# EAGLE design CrowPanel ESP32 Display-5.79(E) Inch (EAGLE 9.6.2)
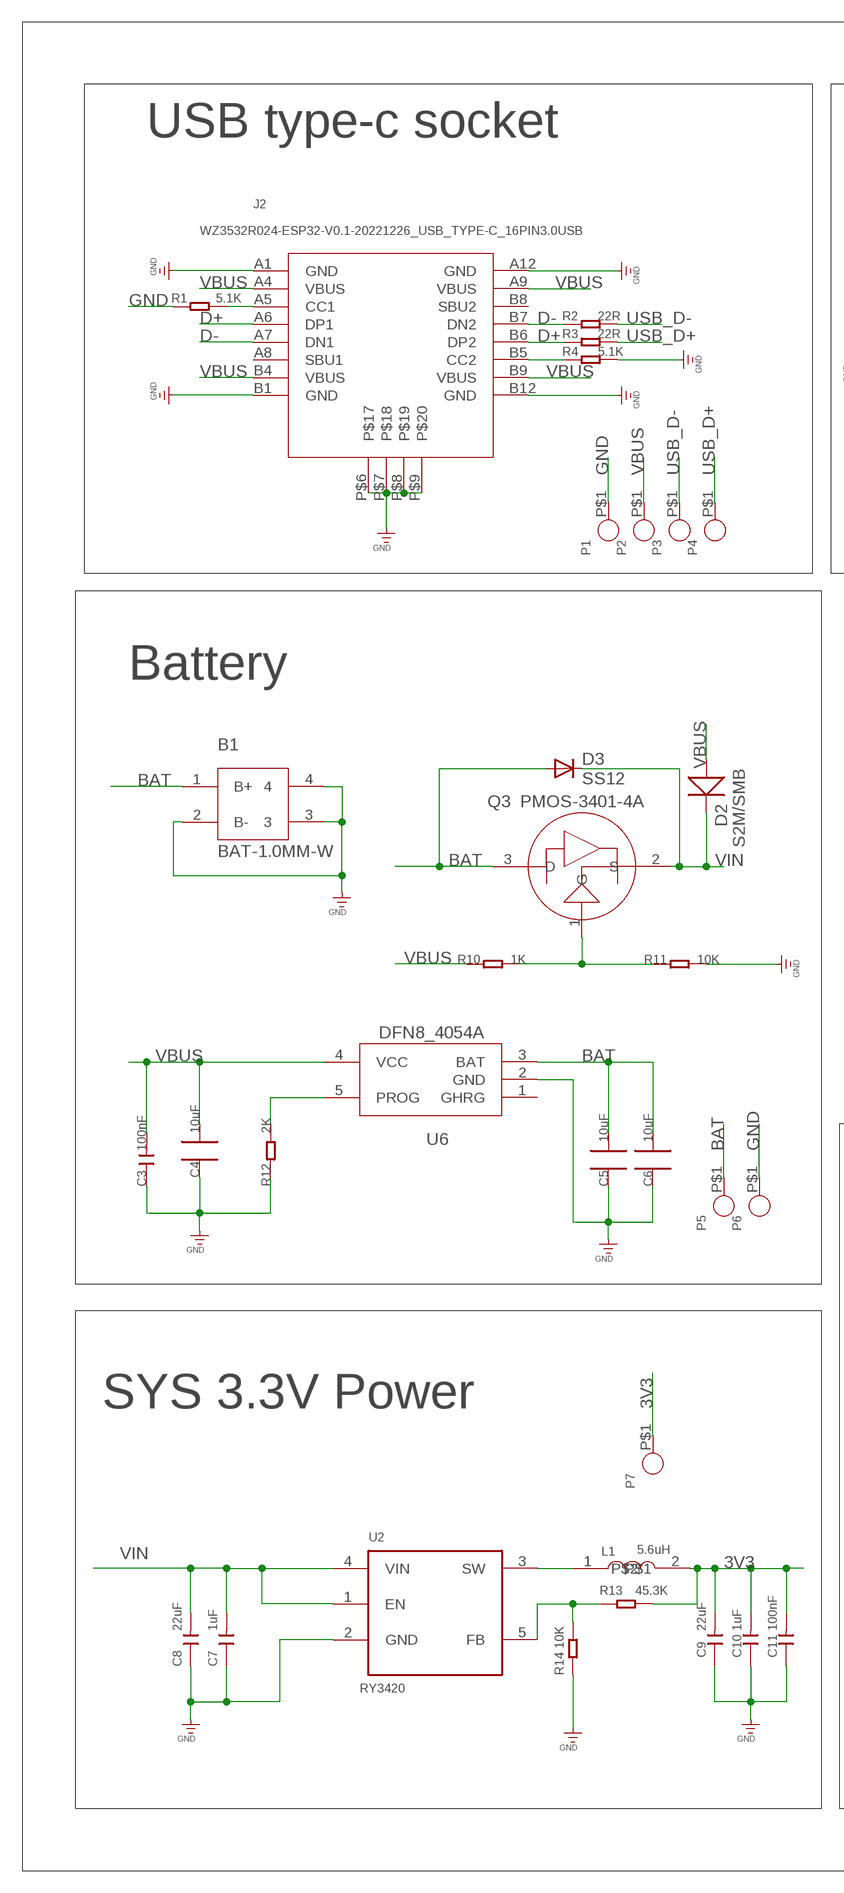
[diagram p0: schematic, sheet 1, part 1 of 2]
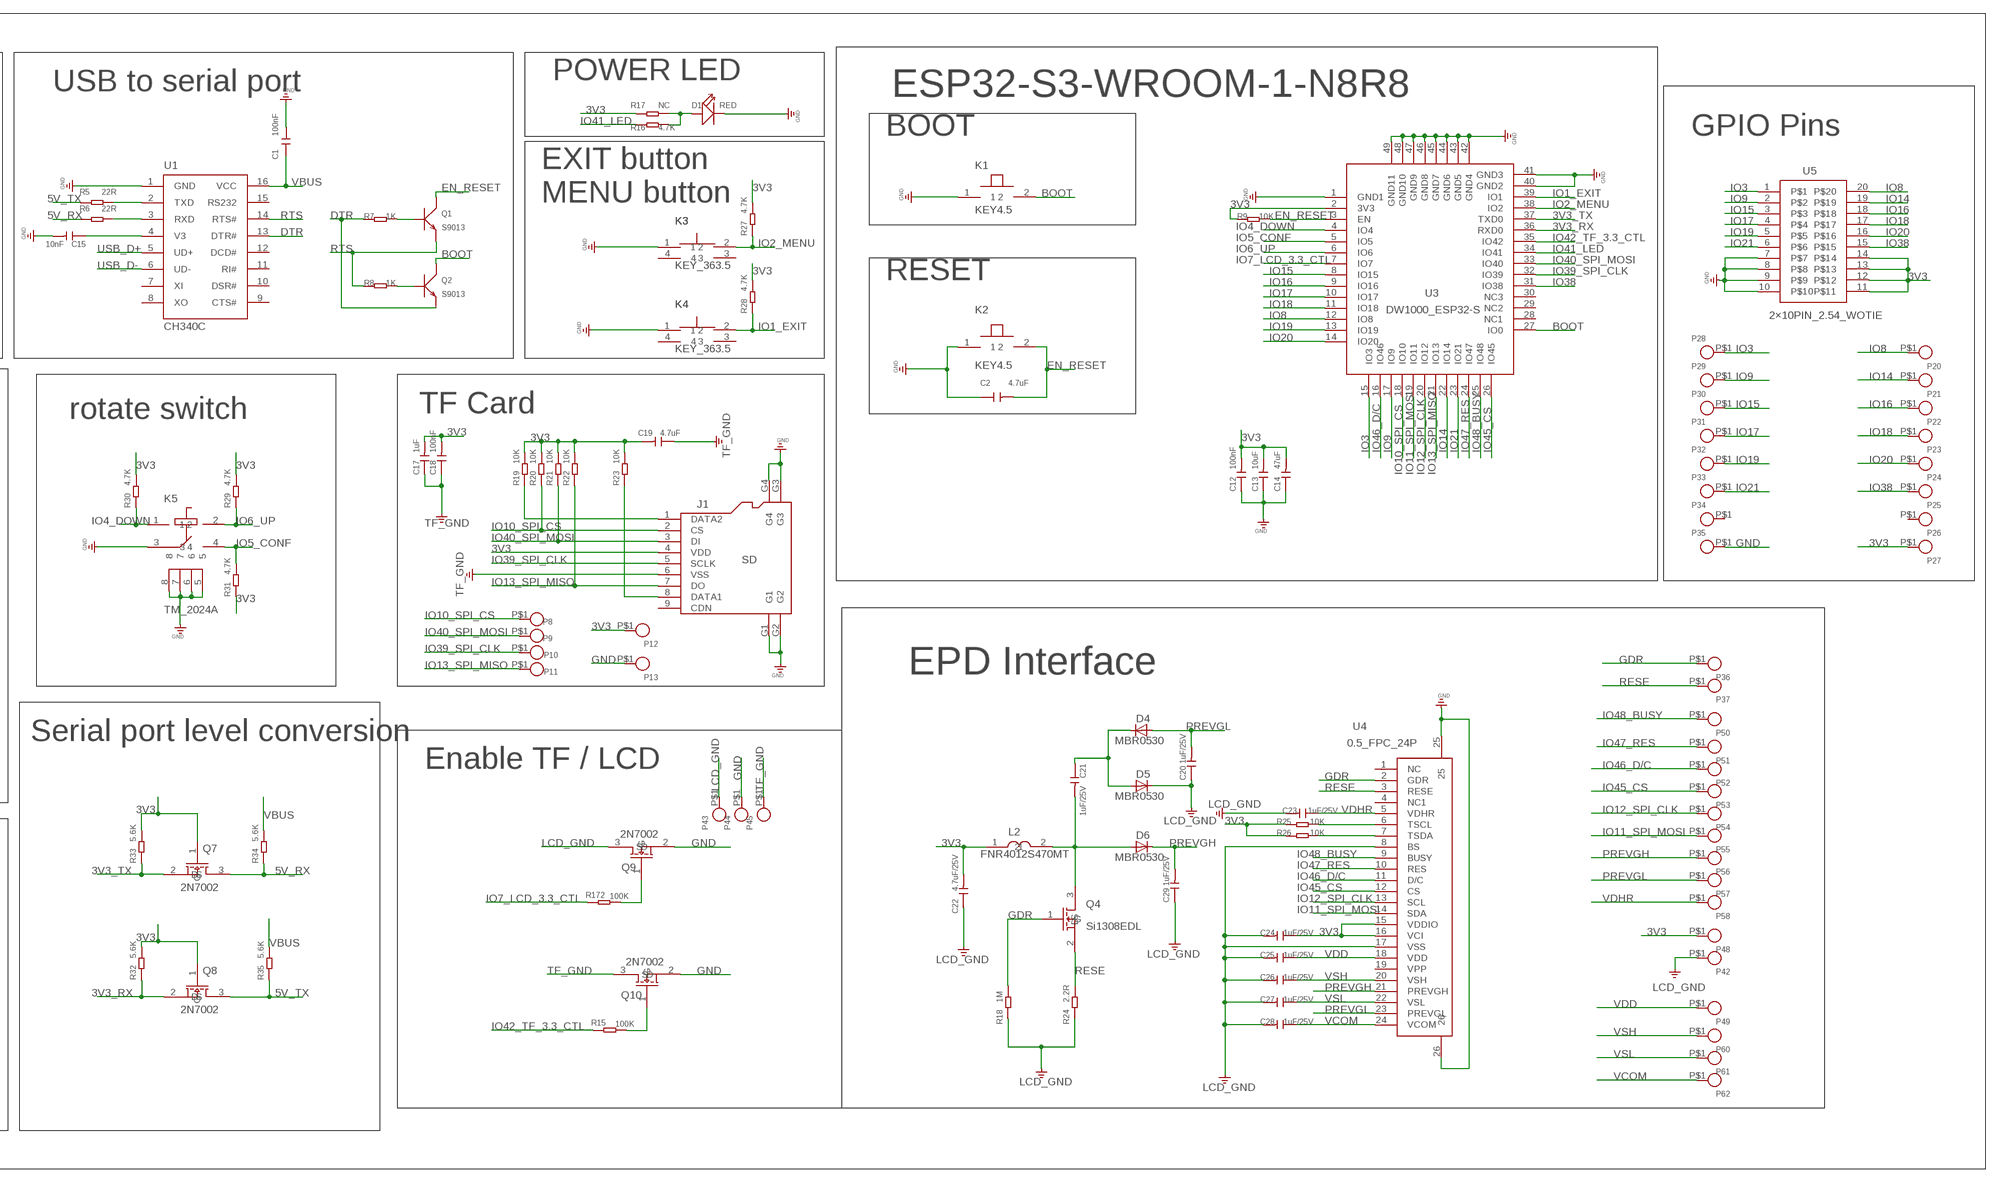
[diagram p1: schematic, sheet 1, part 2 of 2]

## Parts
B1  BAT-1.0MM-W  [SH1.0MM-W]
C1  100nF  C0603  [0603]
C2  4.7uF  A_XBJ_C0603  [A_XBJ_0603]
C3  100nF  A9G_DISCRETE_C-0603  [A9G_DISCRETE_C0603]
C4  10uF  CPT_SMD_C0805_S  [CPT_SMD_0805_S]
C5  10uF  CPT_SMD_C0805_S  [CPT_SMD_0805_S]
C6  10uF  CPT_SMD_C0805_S  [CPT_SMD_0805_S]
C7  1uF  A_XBJ_C0603  [A_XBJ_0603]
C8  22uF  A_XBJ_C0805  [A_XBJ_0805]
C9  22uF  A_XBJ_C0805  [A_XBJ_0805]
C10  1uF  A_XBJ_C0603  [A_XBJ_0603]
C11  100nF  A_XBJ_C0603  [A_XBJ_0603]
C12  100nF  A9G_DISCRETE_C-0603  [A9G_DISCRETE_C0603]
C13  10uF  A9G_DISCRETE_C-0603  [A9G_DISCRETE_C0603]
C14  47uF  A9G_DISCRETE_C-0805  [A9G_DISCRETE_C0805]
C15  10nF  A_XBJ_C0603  [A_XBJ_0603]
C17  1uF  A9G_DISCRETE_C-0603  [A9G_DISCRETE_C0603]
C18  100nF  A9G_DISCRETE_C-0603  [A9G_DISCRETE_C0603]
C19  4.7uF  A9G_DISCRETE_C-0603  [A9G_DISCRETE_C0603]
C20  1uF/25V  A9G_DISCRETE_C-0603  [A9G_DISCRETE_C0603]
C21  1uF/25V  A9G_DISCRETE_C-0603  [A9G_DISCRETE_C0603]
C22  4.7uF/25V  A9G_DISCRETE_C-0603  [A9G_DISCRETE_C0603]
C23  1uF/25V  A9G_DISCRETE_C-0603  [A9G_DISCRETE_C0603]
C24  1uF/25V  A9G_DISCRETE_C-0603  [A9G_DISCRETE_C0603]
C25  1uF/25V  A9G_DISCRETE_C-0603  [A9G_DISCRETE_C0603]
C26  1uF/25V  A9G_DISCRETE_C-0603  [A9G_DISCRETE_C0603]
C27  1uF/25V  A9G_DISCRETE_C-0603  [A9G_DISCRETE_C0603]
C28  1uF/25V  A9G_DISCRETE_C-0603  [A9G_DISCRETE_C0603]
C29  1uF/25V  A9G_DISCRETE_C-0603  [A9G_DISCRETE_C0603]
D1  RED  A_XBJ_DISCRETE_LED0603  [A_XBJ_DISCRETE_LED-0603]
D2  S2M/SMB  DO-214AB_214ABDO-214AB  [DO-214AB_214AB]
D3  SS12  DIODE_DIODE-DO-214AC  [DIODE_DO-214AC]
D4  MBR0530  DIODE_DIODE-SOD123  [DIODE_SOD123]
D5  MBR0530  DIODE_DIODE-SOD123  [DIODE_SOD123]
D6  MBR0530  DIODE_DIODE-SOD123  [DIODE_SOD123]
J1  SD  CONNECTOR_HOLDER-MICROSD-9P  [CONNECTOR_9P-SMD-W/-RING]
J2  WZ3532R024-ESP32-V0.1-20221226_USB_TYPE-C_16PIN3.0USB  [WZ3532R024-ESP32-V0.1-20221226_KEVIN_3.0TYPEC-SMD]
K1  KEY4.5  [KEY-4.5]
K2  KEY4.5  [KEY-4.5]
K3  KEY_363.5  [KEY_3*6*3.5]
K4  KEY_363.5  [KEY_3*6*3.5]
K5  TM_2024A  [TM_2024A]
L1  5.6uH  WZ2432R028-ESP32-V1.2-20231108_L-0530  [WZ2432R028-ESP32-V1.2-20231108_CD54_CD54]
L2  FNR4012S470MT  [FNR4012S470MT]
P1  CROWPI_POW_PADPAD-1.0MM  [CROWPI_POW_PAD-1.0MM]
P2  CROWPI_POW_PADPAD-1.0MM  [CROWPI_POW_PAD-1.0MM]
P3  CROWPI_POW_PADPAD-1.0MM  [CROWPI_POW_PAD-1.0MM]
P4  CROWPI_POW_PADPAD-1.0MM  [CROWPI_POW_PAD-1.0MM]
P5  CROWPI_POW_PADPAD-1.0MM  [CROWPI_POW_PAD-1.0MM]
P6  CROWPI_POW_PADPAD-1.0MM  [CROWPI_POW_PAD-1.0MM]
P7  CROWPI_POW_PADPAD-1.0MM  [CROWPI_POW_PAD-1.0MM]
P8  CROWPI_POW_PADPAD-1.0MM  [CROWPI_POW_PAD-1.0MM]
P9  CROWPI_POW_PADPAD-1.0MM  [CROWPI_POW_PAD-1.0MM]
P10  CROWPI_POW_PADPAD-1.0MM  [CROWPI_POW_PAD-1.0MM]
P11  CROWPI_POW_PADPAD-1.0MM  [CROWPI_POW_PAD-1.0MM]
P12  CROWPI_POW_PADPAD-1.0MM  [CROWPI_POW_PAD-1.0MM]
P13  CROWPI_POW_PADPAD-1.0MM  [CROWPI_POW_PAD-1.0MM]
P20  CROWPI_POW_PADPAD-1.0MM  [CROWPI_POW_PAD-1.0MM]
P21  CROWPI_POW_PADPAD-1.0MM  [CROWPI_POW_PAD-1.0MM]
P22  CROWPI_POW_PADPAD-1.0MM  [CROWPI_POW_PAD-1.0MM]
P23  CROWPI_POW_PADPAD-1.0MM  [CROWPI_POW_PAD-1.0MM]
P24  CROWPI_POW_PADPAD-1.0MM  [CROWPI_POW_PAD-1.0MM]
P25  CROWPI_POW_PADPAD-1.0MM  [CROWPI_POW_PAD-1.0MM]
P26  CROWPI_POW_PADPAD-1.0MM  [CROWPI_POW_PAD-1.0MM]
P27  CROWPI_POW_PADPAD-1.0MM  [CROWPI_POW_PAD-1.0MM]
P28  CROWPI_POW_PADPAD-1.0MM  [CROWPI_POW_PAD-1.0MM]
P29  CROWPI_POW_PADPAD-1.0MM  [CROWPI_POW_PAD-1.0MM]
P30  CROWPI_POW_PADPAD-1.0MM  [CROWPI_POW_PAD-1.0MM]
P31  CROWPI_POW_PADPAD-1.0MM  [CROWPI_POW_PAD-1.0MM]
P32  CROWPI_POW_PADPAD-1.0MM  [CROWPI_POW_PAD-1.0MM]
P33  CROWPI_POW_PADPAD-1.0MM  [CROWPI_POW_PAD-1.0MM]
P34  CROWPI_POW_PADPAD-1.0MM  [CROWPI_POW_PAD-1.0MM]
P35  CROWPI_POW_PADPAD-1.0MM  [CROWPI_POW_PAD-1.0MM]
P36  CROWPI_POW_PADPAD-1.0MM  [CROWPI_POW_PAD-1.0MM]
P37  CROWPI_POW_PADPAD-1.0MM  [CROWPI_POW_PAD-1.0MM]
P42  CROWPI_POW_PADPAD-1.0MM  [CROWPI_POW_PAD-1.0MM]
P43  CROWPI_POW_PADPAD-1.0MM  [CROWPI_POW_PAD-1.0MM]
P44  CROWPI_POW_PADPAD-1.0MM  [CROWPI_POW_PAD-1.0MM]
P45  CROWPI_POW_PADPAD-1.0MM  [CROWPI_POW_PAD-1.0MM]
P48  CROWPI_POW_PADPAD-1.0MM  [CROWPI_POW_PAD-1.0MM]
P49  CROWPI_POW_PADPAD-1.0MM  [CROWPI_POW_PAD-1.0MM]
P50  CROWPI_POW_PADPAD-1.0MM  [CROWPI_POW_PAD-1.0MM]
P51  CROWPI_POW_PADPAD-1.0MM  [CROWPI_POW_PAD-1.0MM]
P52  CROWPI_POW_PADPAD-1.0MM  [CROWPI_POW_PAD-1.0MM]
P53  CROWPI_POW_PADPAD-1.0MM  [CROWPI_POW_PAD-1.0MM]
P54  CROWPI_POW_PADPAD-1.0MM  [CROWPI_POW_PAD-1.0MM]
P55  CROWPI_POW_PADPAD-1.0MM  [CROWPI_POW_PAD-1.0MM]
P56  CROWPI_POW_PADPAD-1.0MM  [CROWPI_POW_PAD-1.0MM]
P57  CROWPI_POW_PADPAD-1.0MM  [CROWPI_POW_PAD-1.0MM]
P58  CROWPI_POW_PADPAD-1.0MM  [CROWPI_POW_PAD-1.0MM]
P60  CROWPI_POW_PADPAD-1.0MM  [CROWPI_POW_PAD-1.0MM]
P61  CROWPI_POW_PADPAD-1.0MM  [CROWPI_POW_PAD-1.0MM]
P62  CROWPI_POW_PADPAD-1.0MM  [CROWPI_POW_PAD-1.0MM]
Q1  S9013  DISCRETE_TRANSISTOR-NPN-SOT23  [DISCRETE_SOT23$1]
Q2  S9013  DISCRETE_TRANSISTOR-NPN-SOT23  [DISCRETE_SOT23$1]
Q3  PMOS-3401-4A  DFN8_P-MOS-SOT23  [DFN8_SOT-23]
Q4  Si1308EDL  HXY2102EI  [SOT-323_W]
Q7  2N7002  NMOS_W  [SOT23-3_W]
Q8  2N7002  NMOS_W  [SOT23-3_W]
Q9  2N7002  NMOS_W  [SOT23-3_W]
Q10  2N7002  NMOS_W  [SOT23-3_W]
R1  5.1K  R0603  [R0603]
R2  22R  R0603  [R0603]
R3  22R  R0603  [R0603]
R4  5.1K  R0603  [R0603]
R5  22R  R0603  [R0603]
R6  22R  R0603  [R0603]
R7  1K  A9G_DISCRETE_R-0603  [A9G_DISCRETE_R0603]
R8  1K  A9G_DISCRETE_R-0603  [A9G_DISCRETE_R0603]
R9  10K  A9G_DISCRETE_R-0603  [A9G_DISCRETE_R0603]
R10  1K  A9G_DISCRETE_R-0603  [A9G_DISCRETE_R0603]
R11  10K  A9G_DISCRETE_R-0603  [A9G_DISCRETE_R0603]
R12  2K  A9G_DISCRETE_R-0603  [A9G_DISCRETE_R0603]
R13  45.3K  A9G_DISCRETE_R-0603  [A9G_DISCRETE_R0603]
R14  10K  A9G_DISCRETE_R-0603  [A9G_DISCRETE_R0603]
R15  100K  R-0603  [R0603]
R16  4.7K  A9G_DISCRETE_R-0603  [A9G_DISCRETE_R0603]
R17  NC  A9G_DISCRETE_R-0603  [A9G_DISCRETE_R0603]
R18  1M  A9G_DISCRETE_R-0603  [A9G_DISCRETE_R0603]
R19  10K  A9G_DISCRETE_R-0603  [A9G_DISCRETE_R0603]
R20  10K  A9G_DISCRETE_R-0603  [A9G_DISCRETE_R0603]
R21  10K  A9G_DISCRETE_R-0603  [A9G_DISCRETE_R0603]
R22  10K  A9G_DISCRETE_R-0603  [A9G_DISCRETE_R0603]
R23  10K  A9G_DISCRETE_R-0603  [A9G_DISCRETE_R0603]
R24  2.2R  A9G_DISCRETE_R-0603  [A9G_DISCRETE_R0603]
R25  10K  A9G_DISCRETE_R-0603  [A9G_DISCRETE_R0603]
R26  10K  A9G_DISCRETE_R-0603  [A9G_DISCRETE_R0603]
R27  4.7K  A9G_DISCRETE_R-0603  [A9G_DISCRETE_R0603]
R28  4.7K  A9G_DISCRETE_R-0603  [A9G_DISCRETE_R0603]
R29  4.7K  A9G_DISCRETE_R-0603  [A9G_DISCRETE_R0603]
R30  4.7K  A9G_DISCRETE_R-0603  [A9G_DISCRETE_R0603]
R31  4.7K  A9G_DISCRETE_R-0603  [A9G_DISCRETE_R0603]
R32  5.6K  DISCRETE_R-0603  [DISCRETE_R0603]
R33  5.6K  DISCRETE_R-0603  [DISCRETE_R0603]
R34  5.6K  DISCRETE_R-0603  [DISCRETE_R0603]
R35  5.6K  DISCRETE_R-0603  [DISCRETE_R0603]
R172  100K  R-0603  [R0603]
U1  CH340C  A_XBJ_CH340G  [A_XBJ_SOP-16]
U2  RY3420  CROWBOT_-V1.0-20220525_A_XBJ_HM3420B  [CROWBOT_-V1.0-20220525_A_XBJ_SOT23-5]
U3  DW1000_ESP32-S  [DW1000_ESP32-S3]
U4  0.5_FPC_24P  [0.5_FPC_24P]
U5  2×10PIN_2.54_WOTIE  [2*10PIN_2.54_WOTIE]
U6  DFN8_4054A  [DFN8_SOP23-5]

## Nets
3V3: C9.2 C10.2 C11.2 C12.2 C13.2 C14.2 C17.2 C18.2 C19.2 C22.2 C24.1 J1.4(VDD) L1.2 L2.1 P7.P$1 P12.P$1 P27.P$1 P48.P$1 Q7.1(G) Q8.1(G) R9.1 R13.2 R17.1 R19.2 R20.2 R21.2 R22.2 R23.2 R25.2 R26.2 R27.2 R28.2 R29.2 R30.2 R31.1 R32.2 R33.2 U3.2(3V3) U4.15(VDDIO) U4.16(VCI) U5.11 U5.12 U5.13 U5.14
3V3_RX: Q8.2(S) R32.1 U3.36(RXD0)
3V3_TX: Q7.2(S) R33.1 U3.37(TXD0)
5V_RX: Q7.3(D) R6.1 R34.1
5V_TX: Q8.3(D) R5.1 R35.1
BAT: B1.1(B+) C5.2 C6.2 D3.A P5.P$1 Q3.3(D) U6.3(BAT)
BOOT: K1.2 Q2.3(C) U3.27(IO0)
D+: J2.A6(DP1) J2.B6(DP2) R3.1
D-: J2.A7(DN1) J2.B7(DN2) R2.1
DTR: Q2.2(E) R7.1 U1.13(DTR#)
EN_RESET: C2.2 K2.2 Q1.3(C) R9.2 U3.3(EN)
GDR: P36.P$1 Q4.1(G) R18.2 U4.2(GDR)
GND: B1.2(B-) B1.3 B1.4 C1.2 C2.1 C3.1 C4.1 C5.1 C6.1 C7.1 C8.1 C9.1 C10.1 C11.1 C12.1 C13.1 C14.1 C15.2 D1.- J1.G1 J1.G2 J1.G3 J1.G4 J2.A1(GND) J2.A12(GND) J2.B1(GND) J2.B12(GND) J2.P$6 J2.P$7 J2.P$8 J2.P$9 K1.1 K2.1 K3.1 K4.1 K5.3 K5.5 K5.6 K5.7 K5.8 P1.P$1 P6.P$1 P13.P$1 P35.P$1 P44.P$1 Q9.2(S) Q10.2(S) R1.1 R4.2 R11.2 R12.1 R14.1 U1.1(GND) U2.2(GND) U3.1(GND1) U3.40(GND2) U3.41(GND3) U3.42(GND4) U3.43(GND5) U3.44(GND6) U3.45(GND7) U3.46(GND8) U3.47(GND9) U3.48(GND10) U3.49(GND11) U4.25 U4.26 U5.7 U5.8 U5.9 U5.10 U6.2(GND)
IO1_EXIT: K4.2 R28.1 U3.39(IO1)
IO2_MENU: K3.2 R27.1 U3.38(IO2)
IO3: P28.P$1 U3.15(IO3) U5.1
IO4_DOWN: K5.1 R30.1 U3.4(IO4)
IO5_CONF: K5.4 R31.2 U3.5(IO5)
IO6_UP: K5.2 R29.1 U3.6(IO6)
IO7_LCD_3.3_CTL: R172.1 U3.7(IO7)
IO8: P20.P$1 U3.12(IO8) U5.20
IO9: P29.P$1 U3.17(IO9) U5.2
IO10_SPI_CS: J1.2(CS) P8.P$1 R20.1 U3.18(IO10)
IO11_SPI_MOSI: P55.P$1 U3.19(IO11) U4.14(SDA)
IO12_SPI_CLK: P54.P$1 U3.20(IO12) U4.13(SCL)
IO13_SPI_MISO: J1.7(DO) P11.P$1 R22.1 U3.21(IO13)
IO14: P21.P$1 U3.22(IO14) U5.19
IO15: P30.P$1 U3.8(IO15) U5.3
IO16: P22.P$1 U3.9(IO16) U5.18
IO17: P31.P$1 U3.10(IO17) U5.4
IO18: P23.P$1 U3.11(IO18) U5.17
IO19: P32.P$1 U3.13(IO19) U5.5
IO20: P24.P$1 U3.14(IO20) U5.16
IO21: P33.P$1 U3.23(IO21) U5.6
IO38: P25.P$1 U3.31(IO38) U5.15
IO39_SPI_CLK: J1.5(SCLK) P10.P$1 U3.32(IO39)
IO40_SPI_MOSI: J1.3(DI) P9.P$1 R21.1 U3.33(IO40)
IO41_LED: R16.1 U3.34(IO41)
IO42_TF_3.3_CTL: R15.1 U3.35(IO42)
IO45_CS: P53.P$1 U3.26(IO45) U4.12(CS)
IO46_D/C: P52.P$1 U3.16(IO46) U4.11(D/C)
IO47_RES: P51.P$1 U3.24(IO47) U4.10(RES)
IO48_BUSY: P50.P$1 U3.25(IO48) U4.9(BUSY)
LCD_GND: C20.1 C22.1 C23.2 C24.2 C25.2 C26.2 C27.2 C28.2 C29.1 D5.C P42.P$1 P43.P$1 Q9.3(D) R18.1 R24.1 U4.8(BS) U4.17(VSS) ; supply symbol labelled GND
N$1: Q1.1(B) R7.2
N$2: R5.2 U1.2(TXD)
N$3: R6.2 U1.3(RXD)
N$4: Q2.1(B) R8.2
N$5: J2.A5(CC1) R1.2
N$6: Q3.1(G) R10.2 R11.1
N$7: Q9.1(G) R172.2
N$8: Q10.1(G) R15.2
N$9: R13.1 R14.2 U2.5(FB)
N$10: J1.1(DATA2) R19.1
N$11: L1.1 U2.3(SW)
N$12: J2.B5(CC2) R4.1
N$13: C15.1 U1.4(V3)
N$16: R12.2 U6.5(PROG)
N$18: R25.1 U4.6(TSCL)
N$19: R26.1 U4.7(TSDA)
N$20: J1.8(DATA1) R23.1
N$25: D1.+ R16.2 R17.2
N$55: C21.1 D4.C D5.A
N$56: C21.2 D6.A L2.2 Q4.3(D)
PREVGH: C29.2 D6.C P56.P$1 U4.21(PREVGH)
PREVGL: C20.2 D4.A P57.P$1 U4.23(PREVGL)
RESE: P37.P$1 Q4.2(S) R24.2 U4.3(RESE)
RTS: Q1.2(E) R8.1 U1.14(RTS#)
TF_GND: C17.1 C18.1 C19.1 J1.6(VSS) P45.P$1 Q10.3(D) ; supply symbol labelled GND
USB_D+: P4.P$1 R3.2 U1.5(UD+)
USB_D-: P3.P$1 R2.2 U1.6(UD-)
VBUS: C1.1 C3.2 C4.2 D2.1(+) J2.A4(VBUS) J2.A9(VBUS) J2.B4(VBUS) J2.B9(VBUS) P2.P$1 R10.1 R34.2 R35.2 U1.16(VCC) U6.4(VCC)
VCOM: C28.1 P62.P$1 U4.24(VCOM)
VDD: C25.1 P49.P$1 U4.18(VDD)
VDHR: C23.1 P58.P$1 U4.5(VDHR)
VIN: C7.2 C8.2 D2.2(-) D3.C Q3.2(S) U2.1(EN) U2.4(VIN)
VSH: C26.1 P60.P$1 U4.20(VSH)
VSL: C27.1 P61.P$1 U4.22(VSL)
Unconnected: J1.9(CDN) J2.A8(SBU1) J2.B8(SBU2) K3.3 K3.4 K4.3 K4.4 P26.P$1 P34.P$1 U1.7(XI) U1.8(XO) U1.9(CTS#) U1.10(DSR#) U1.11(RI#) U1.12(DCD#) U1.15(RS232) U3.28(NC1) U3.29(NC2) U3.30(NC3) U4.1(NC) U4.4(NC1) U4.19(VPP) U6.1(GHRG)

## Notes on the sheet
- USB type-c socket | POWER LED
- USB to serial port | ESP32-S3-WROOM-1-N8R8
- BOOT | GPIO Pins
- EXIT button 
  MENU button
- RESET
- rotate switch | TF Card
- Battery
- EPD Interface
- Serial port level conversion
- Enable TF / LCD
- SYS 3.3V Power

## Library data of the parts
B1 = WGH:BAT-1.0MM-W
C1 = WGH:C0603
C2 C7 C10 C11 C15 = CrowPanel ESP32 Display-4.3-inch-V2.1-20240314:A_XBJ_C0603
C3 C12-C14 C17-C29 = CrowPanel ESP32 Display-4.3-inch-V2.1-20240314:A9G_DISCRETE_C*: Ceramic Capacitors
C4-C6 = CrowPanel ESP32 Display-4.3-inch-V2.1-20240314:CPT_SMD_C0805
C8 C9 = CrowPanel ESP32 Display-4.3-inch-V2.1-20240314:A_XBJ_C0805
D1 = CrowPanel ESP32 Display-4.3-inch-V2.1-20240314:A_XBJ_DISCRETE_LED*
D2 = CrowPanel ESP32 Display-4.3-inch-V2.1-20240314:DO-214AB_214AB: 214AB
D3-D6 = CrowPanel ESP32 Display-4.3-inch-V2.1-20240314:DIODE_DIODE-: DIODE
J1 = CrowPanel ESP32 Display-4.3-inch-V2.1-20240314:CONNECTOR_HOLDER-MICROSD-9P
J2 = CrowPanel ESP32 Display-4.3-inch-V2.1-20240314:WZ3532R024-ESP32-V0.1-20221226_USB_TYPE-C_16PIN
K1 K2 = WGH:KEY4.5
K3 K4 = WGH:KEY_3*6*3.5
K5 = WGH:TM_2024A
L1 = CrowPanel ESP32 Display-4.3-inch-V2.1-20240314:WZ2432R028-ESP32-V1.2-20231108_L-0530
L2 = WGH:FNR4012S470MT
P1-P13 P20-P37 P42-P45 P48-P58 P60-P62 = ESP32 Terminal - 3.5 Inch_2.0:CROWPI_POW_PAD*
Q1 Q2 = CrowPanel ESP32 Display-4.3-inch-V2.1-20240314:DISCRETE_TRANSISTOR-NPN*: NPN audion
Q3 = CrowPanel ESP32 Display-4.3-inch-V2.1-20240314:DFN8_P-MOS-SOT23
Q4 = WGH:HXY2102EI
Q7-Q10 = WGH:NMOS_W
R1-R6 = WGH:R0603
R7-R14 R16-R31 = CrowPanel ESP32 Display-4.3-inch-V2.1-20240314:A9G_DISCRETE_R*
R15 R172 = discrete:R*
R32-R35 = CrowPanel ESP32 Display-4.3-inch-V2.1-20240314:DISCRETE_R*
U1 = CrowPanel ESP32 Display-4.3-inch-V2.1-20240314:A_XBJ_CH340G
U2 = CrowPanel ESP32 Display-4.3-inch-V2.1-20240314:CROWBOT_-V1.0-20220525_A_XBJ_HM3420B
U3 = CrowPanel ESP32 Display-4.3-inch-V2.1-20240314:DW1000_ESP32-S
U4 = ESP32 Terminal - 3.5 Inch_2.0:0.5_FPC_24P
U5 = WGH:2×10PIN_2.54_WOTIE
U6 = CrowPanel ESP32 Display-4.3-inch-V2.1-20240314:DFN8_4054A

## Net classes
0 default: width 0.254 mm, drill 0.305 mm, clearance 0.152 mm

## Board
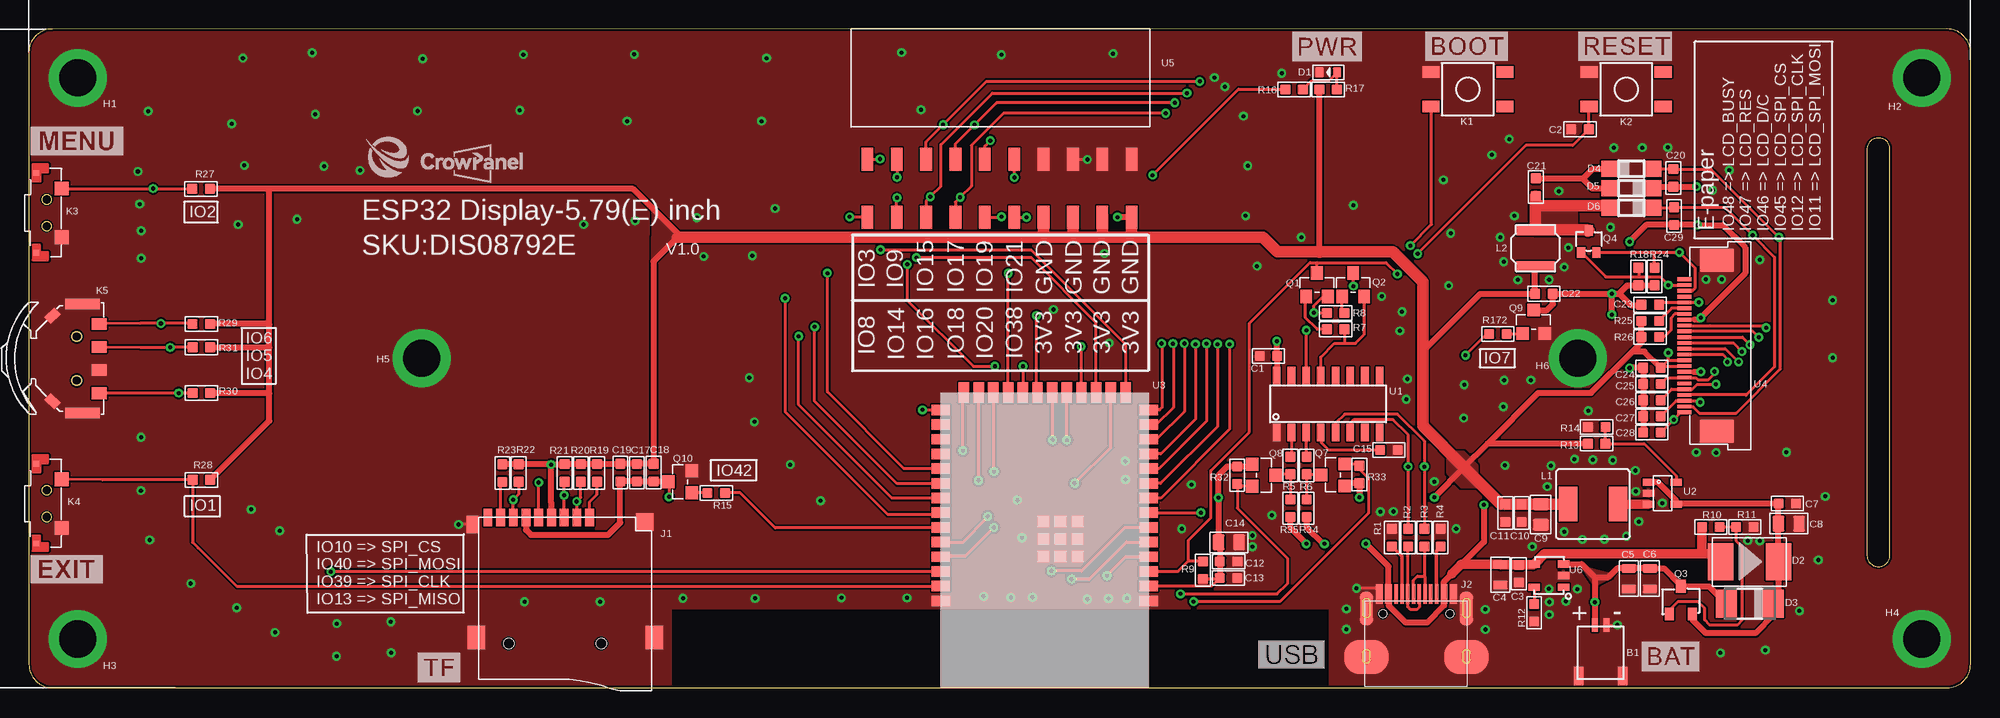
[diagram p2: board, top side]
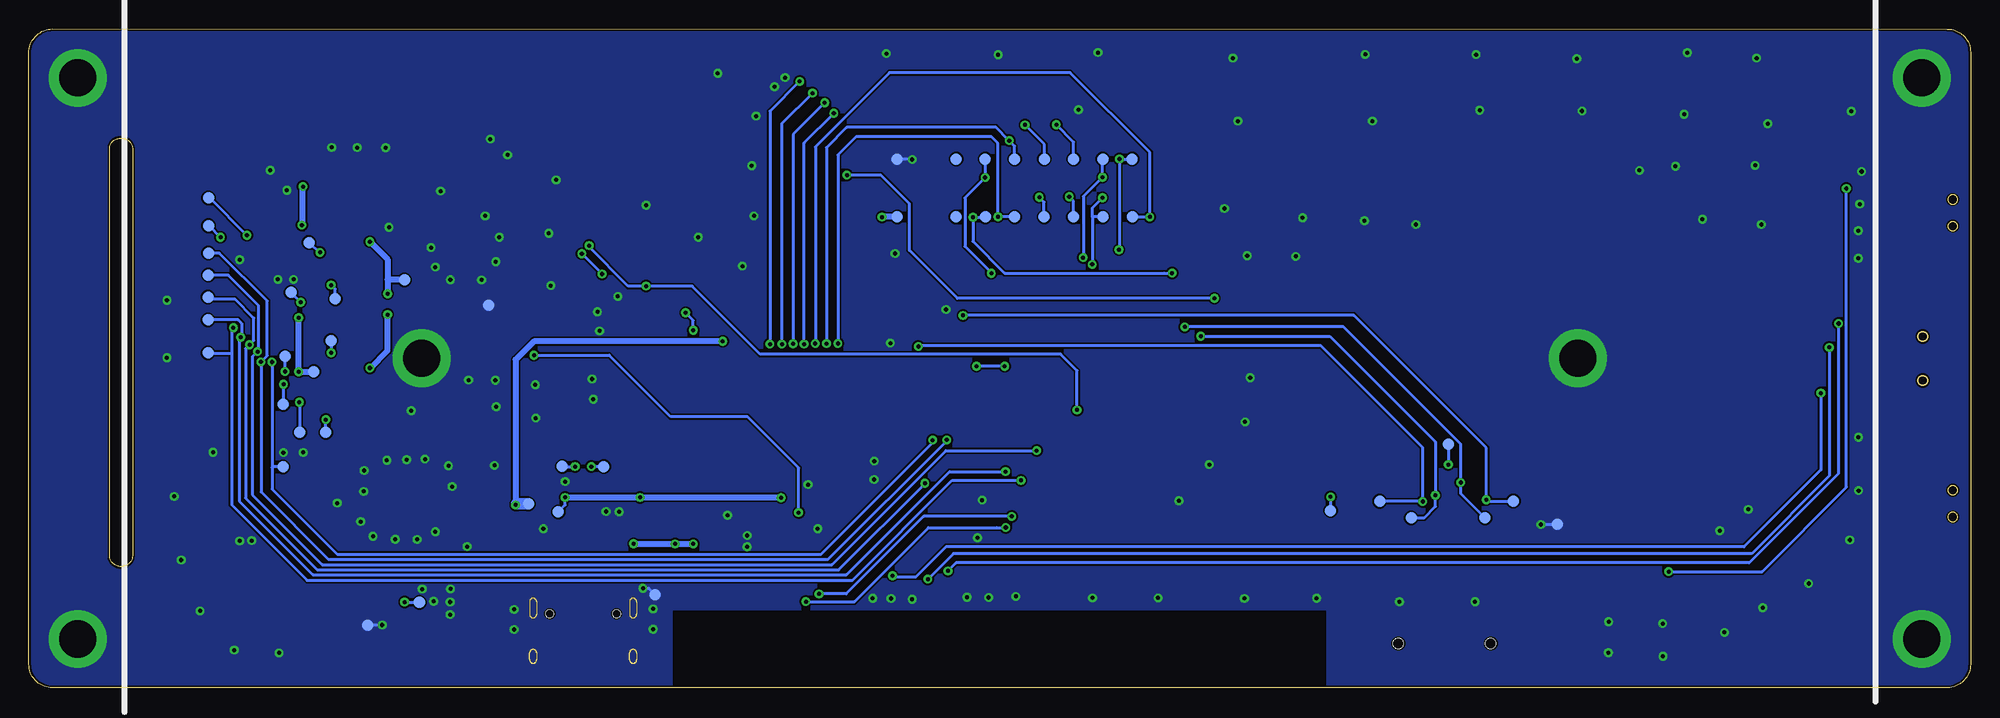
[diagram p3: board, bottom side, seen from below]

Size 167.92 x 56.97 mm. Coordinates in mm from the lower left corner, seen from the top.
Outline: 165.87,56.97 2.01,56.95 arc90 0,54.95 0,2.06 arc90 2.02,0.01 165.87,0 arc90 167.92,2.05 167.92,54.89 arc90 165.87,56.97
Outline: 158.96,11.43 arc90 159.96,10.48 arc90 160.95,11.46 160.95,46.57 arc90 159.99,47.53 159.92,47.53 arc90 158.96,46.57 158.96,11.43
Copper layers (1*16): Top 0.035mm / dielectric 1.5mm / Bottom 0.035mm
Design rules "default *": minimum track width 6mil, minimum drill 0.35mm, track to track 6mil, track to pad 6mil, pad to pad 6mil, via to via 6mil, smd to smd 6mil, copper to edge 6mil, drill to drill 6mil, minimum pad ring 10mil, minimum via ring 8mil, stop-mask expansion 4mil, vias tented up to drill 100mil, thermal gap 0mil

### Footprints (pad centres in the part's own frame; a part is rotated, then mirrored left to right if it is on the bottom)
SH1.0MM-W = smd 0.5 x 1.2: 1 -0.5,2.4; 2 0.5,2.4 | smd 0.8 x 1.6: 3 -1.9,-2; 4 1.9,-2
0603 = smd 0.889 x 0.889: 1 -0.762,0; 2 0.762,0
A_XBJ_0603 = smd 0.889 x 0.889: 1 -0.762,0; 2 0.762,0
A9G_DISCRETE_C0603 = smd 0.889 x 0.889: 1 -0.762,0; 2 0.762,0
CPT_SMD_0805_S = smd 0.762 x 1.27: 1 -0.889,0; 2 0.889,0
A_XBJ_0805 = smd 1.016 x 1.397: 1 -0.889,0; 2 0.889,0
A9G_DISCRETE_C0805 = smd 1.016 x 1.397: 1 -0.889,0; 2 0.889,0
A_XBJ_DISCRETE_LED-0603 = smd 0.762 x 0.889: + -0.762,0; - 0.762,0
DO-214AB_214AB = smd 2.2 x 3.2: 1 -2.5,0; 2 2.5,0
DIODE_DO-214AC = smd 1.8 x 2.4: A 2.025,0; C -2.025,0
DIODE_SOD123 = smd 1.4 x 1.4: A 1.9,0; C -1.9,0
CONNECTOR_9P-SMD-W/-RING = smd 1.524 x 0.762: 1 0,4.4; 2 0,3.3; 3 0,2.2; 4 0,1.1; 5 0,0; 6 0,-1.1; 7 0,-2.2; 8 0,-3.3; 9 0,-4.4 | smd 1.524 x 1.016: G1 0.6,-5.746 | smd 2.032 x 1.524: G2 10.373,-5.4; G3 10.373,10 | smd 1.524 x 1.524: G4 0.392,9.181 | hole 0.889: 10.9,-2.6; 10.9,5.4
WZ3532R024-ESP32-V0.1-20221226_KEVIN_3.0TYPEC-SMD = smd 0.3 x 1.7: A1 -3.35,0.5; A4 -2.55,0.5; A5 -1.25,0.5; A6 -0.25,0.5; A7 0.25,0.5; A8 1.25,0.5; A9 2.55,0.5; A12 3.35,0.5; B1 3.05,0.5; B4 2.25,0.5; B5 1.75,0.5; B6 0.75,0.5; B7 -0.75,0.5; B8 -1.75,0.5; B9 -2.25,0.5; B12 -3.05,0.5 | smd 1.143 x 2.921: P$6 -4.318,-0.762; P$7 4.318,-0.762 | smd 3.81 x 2.921: P$8 -4.318,-4.953; P$9 4.318,-4.953 | hole 0.68: -2.89,-1.22; 2.89,-1.22
KEY-4.5 = smd 1.5 x 1: 1 -3.2,1.5; 2 -3.2,-1.5; 3 3.2,-1.5; 4 3.2,1.5
KEY_3*6*3.5 = smd 1.2 x 1.2: 1 -2.1,-2.6; 2 2.1,-2.6 | smd 0.5 x 0.5: 3 3.45,-0.4; 4 -3.45,-0.4
TM_2024A = smd 1 x 1.3: 1 -3,0.65; 2 3,0.65; 3 -1,0.65; 4 1,0.65 | smd 0.9 x 3: 5 -4.7,2.1; 6 4.7,2.1 | smd 1.2 x 0.8 rotated 45: 7 -3.7,4.7 | smd 1.2 x 0.8 rotated 135: 8 3.7,4.7
WZ2432R028-ESP32-V1.2-20231108_CD54_CD54 = smd 3 x 1.6: 1 0,2.159; 2 0,-2.159
FNR4012S470MT = smd 0.95 x 3.3: 1 -1.6,0; 2 1.6,0
CROWPI_POW_PAD-1.0MM = smd 1 x 1: P$1 0,0
DISCRETE_SOT23$1 = smd 1.016 x 1.143: 1 -0.95,-1.016; 2 0.95,-1.016; 3 0,1.016
DFN8_SOT-23 = smd 1.1 x 0.8: 1 1.2,-1; 2 1.2,1 | smd 1.1 x 0.9: 3 -1.2,0
SOT-323_W = smd 0.7 x 0.9: 1 -0.65,-0.95; 2 0.65,-0.95; 3 0,0.95
SOT23-3_W = smd 1.1 x 1.1: 1 -0.95,-1.016; 2 0.95,-1.016; 3 0,1.016
R0603 = smd 0.889 x 0.889: 1 -0.762,0; 2 0.762,0
A9G_DISCRETE_R0603 = smd 0.889 x 0.889: 1 -0.762,0; 2 0.762,0
DISCRETE_R0603 = smd 0.889 x 0.889: 1 -0.762,0; 2 0.762,0
A_XBJ_SOP-16 = smd 0.66 x 1.5: 1 -4.445,-2.475; 2 -3.175,-2.475; 3 -1.905,-2.475; 4 -0.635,-2.475; 5 0.635,-2.475; 6 1.905,-2.475; 7 3.175,-2.475; 8 4.445,-2.475; 9 4.445,2.475; 10 3.175,2.475; 11 1.905,2.475; 12 0.635,2.475; 13 -0.635,2.475; 14 -1.905,2.475; 15 -3.175,2.475; 16 -4.445,2.475
CROWBOT_-V1.0-20220525_A_XBJ_SOT23-5 = smd 0.6 x 1: 1 -0.95,-1.2; 2 0,-1.2; 3 0.95,-1.2; 4 0.95,1.2; 5 -0.95,1.2
DW1000_ESP32-S3 = smd 1.6 x 0.9: 1 0,18.01; 2 0,16.74; 3 0,15.47; 4 0,14.2; 5 0,12.93; 6 0,11.66; 7 0,10.39; 8 0,9.12; 9 0,7.85; 10 0,6.58; 11 0,5.31; 12 0,4.04; 13 0,2.77; 14 0,1.5; 27 18,1.5; 28 18,2.77; 29 18,4.04; 30 18,5.31; 31 18,6.58; 32 18,7.85; 33 18,9.12; 34 18,10.39; 35 18,11.66; 36 18,12.93; 37 18,14.2; 38 18,15.47; 39 18,16.74; 40 18,18.01 | smd 0.9 x 1.8: 15 2,0; 16 3.28,0; 17 4.55,0; 18 5.82,0; 19 7.09,0; 20 8.36,0; 21 9.63,0; 22 10.9,0; 23 12.17,0; 24 13.44,0; 25 14.71,0; 26 16,0 | smd 1 x 1: 41 7.64,11.16; 42 9.14,11.16; 43 6.14,11.16; 44 6.14,14.16; 45 7.64,12.66; 46 9.14,12.66; 47 7.64,14.16; 48 9.14,14.16; 49 6.14,12.66
0.5_FPC_24P = smd 1.3 x 0.3: 1 -2.54,5.75; 2 -2.54,5.25; 3 -2.54,4.75; 4 -2.54,4.25; 5 -2.54,3.75; 6 -2.54,3.25; 7 -2.54,2.75; 8 -2.54,2.25; 9 -2.54,1.75; 10 -2.54,1.25; 11 -2.54,0.75; 12 -2.54,0.25; 13 -2.54,-0.25; 14 -2.54,-0.75; 15 -2.54,-1.25; 16 -2.54,-1.75; 17 -2.54,-2.25; 18 -2.54,-2.75; 19 -2.54,-3.25; 20 -2.54,-3.75; 21 -2.54,-4.25; 22 -2.54,-4.75; 23 -2.54,-5.25; 24 -2.54,-5.75 | smd 3 x 2: 25 0.27,-7.4; 26 0.27,7.4
2*10PIN_2.54_WOTIE = smd 1.02 x 2: 1 1.4,-7; 2 3.94,-7; 3 6.48,-7; 4 9.02,-7; 5 11.56,-7; 6 14.1,-7; 7 16.64,-7; 8 19.18,-7; 9 21.72,-7; 10 24.26,-7; 11 24.26,-12; 12 21.72,-12; 13 19.18,-12; 14 16.64,-12; 15 14.1,-12; 16 11.56,-12; 17 9.02,-12; 18 6.48,-12; 19 3.94,-12; 20 1.4,-12
DFN8_SOP23-5 = smd 1 x 0.635: 1 -1.27,1; 2 -1.27,0; 3 -1.27,-1; 4 1.27,-1; 5 1.27,1

### Placement (x,y rotation side)
B1  135.92,3.03 0 top
C1  107.19,28.68 180 top
C2  134.14,48.3 0 top
C3  128.86,9.86 90 top
C4  127.24,9.78 90 top
C5  138.35,9.44 90 top
C6  140.19,9.44 90 top
C7  152.07,15.93 180 top
C8  152.19,14.19 180 top
C9  130.75,14.99 90 top
C10  129.09,15.11 90 top
C11  127.68,15.11 90 top
C12  103.75,10.91 180 top
C13  103.74,9.49 180 top
C14  103.77,12.58 180 top
C15  117.61,20.57 0 top
C17  52.58,18.6 90 top
C18  54.02,18.61 90 top
C19  51.14,18.61 90 top
C20  142.21,44.09 90 top
C21  130.32,43.29 270 top
C22  131.01,34.07 180 top
C23  140.21,33.12 180 top
C24  140.36,27.67 180 top
C25  140.36,26.27 180 top
C26  140.36,24.87 180 top
C27  140.36,23.47 180 top
C28  140.36,22.07 180 top
C29  142.28,40.78 90 top
D1  112.37,53.21 180 top
D2  148.8,10.88 0 top
D3  148.83,7.27 180 top
D4  138.58,44.87 0 top
D5  138.58,43.19 180 top
D6  138.58,41.51 180 top
J1  44.09,14.73 270 top
J2  119.99,7.62 0 top
K1  124.44,51.75 0 top
K2  138.14,51.75 0 top
K3  KEY_36*3.5  [KEY_3*6*3.5]  0.24,41.07 90 top
K4  KEY_36*3.5  [KEY_3*6*3.5]  0.24,15.92 90 top
K5  6.74,28.47 90 top
L1  135.26,15.88 270 top
L2  130.3,38 90 top
P1  113.75,8.05 0 bottom
P2  124.72,15.91 0 bottom
P3  118.2,19.13 0 bottom
P4  121.79,19.14 0 bottom
P5  134.15,7.39 0 bottom
P6  138.63,5.42 0 bottom
P7  122.14,15.21 0 bottom
P8  51.09,16.13 0 bottom
P9  48.36,14.7 0 bottom
P10  41.99,14.69 0 bottom
P11  39.54,16.15 0 bottom
P12  45.17,21.05 0 bottom
P13  35.73,14.16 0 bottom
P20  72.49,40.71 0 bottom
P21  75.05,40.71 0 bottom
P22  77.59,40.71 0 bottom
P23  80.13,40.71 0 bottom
P24  82.67,40.71 0 bottom
P25  85.19,40.71 0 bottom
P26  87.76,40.71 0 bottom
P27  92.84,40.71 0 bottom
P28  72.51,45.72 0 bottom
P29  75.04,45.72 0 bottom
P30  77.57,45.72 0 bottom
P31  80.1,45.72 0 bottom
P32  82.67,45.72 0 bottom
P33  85.23,45.72 0 bottom
P34  87.73,45.72 0 bottom
P35  92.85,45.72 0 bottom
P36  141.43,33.63 0 bottom
P37  143.69,38.5 0 bottom
P42  143.28,27.33 0 bottom
P43  135.44,35.27 0 bottom
P44  128.15,33.07 0 bottom
P45  55.35,15.32 0 bottom
P48  141.8,30.02 0 bottom
P49  145.77,28.66 0 bottom
P50  152.43,28.96 0 bottom
P51  152.43,31.81 0 bottom
P52  152.42,33.77 0 bottom
P53  152.4,35.68 0 bottom
P54  152.39,37.59 0 bottom
P55  145.94,19.11 0 bottom
P56  152.38,42.37 0 bottom
P57  152.38,39.95 0 bottom
P58  145.24,34.19 0 bottom
P60  145.93,24.51 0 bottom
P61  144.5,22.08 0 bottom
P62  142.24,22.08 0 bottom
Q1  111.4,34.84 0 top
Q2  114.52,34.84 0 top
Q3  142.86,7.58 270 top
Q4  134.89,38.59 0 top
Q7  112.78,18.41 90 top
Q8  106.81,18.38 270 top
Q9  130.12,31.64 0 top
Q10  56.32,17.81 90 top
R1  117.87,12.99 270 top
R2  119.28,12.99 90 top
R3  120.69,12.99 90 top
R4  122.1,12.99 90 top
R5  109.1,19.22 90 top
R6  110.5,19.22 90 top
R7  113.01,31 180 top
R8  113.01,32.41 0 top
R9  101.53,10.16 90 top
R10  145.46,13.91 0 top
R11  148.39,13.91 0 top
R12  130.18,6.49 90 top
R13  135.58,21.11 180 top
R14  135.59,22.55 0 top
R15  59.44,16.85 180 top
R16  109.42,51.74 0 top
R17  112.36,51.73 0 top
R18  139.18,35.56 90 top
R19  49.13,18.58 90 top
R20  47.73,18.58 90 top
R21  46.33,18.58 90 top
R22  42.35,18.57 90 top
R23  40.95,18.56 90 top
R24  140.58,35.56 90 top
R25  140.21,31.72 180 top
R26  140.21,30.32 180 top
R27  14.89,43.14 0 top
R28  14.92,17.98 0 top
R29  14.91,31.46 0 top
R30  14.92,25.48 0 top
R31  14.92,29.44 180 top
R32  104.5,18.38 90 top
R33  115.06,18.44 270 top
R34  110.5,15.53 270 top
R35  109.09,15.53 270 top
R172  127.04,30.6 0 top
U1  112.36,24.54 0 top
U2  141.27,16.82 270 top
U3  96.85,25.53 180 top
U4  145.7,29.57 0 top
U5  71.11,52.7 0 top
U6  131.45,9.7 180 top
U$30  [LOGO-1]  28.79,43.52 0 top
U$41  [LOGO-MIN]  34.89,43.81 0 top

### Tracks (layer width: path | path; a pad name or v marks a point on that pad's centre or on a via)
3V3  (via drill 0.35)
  Top 0.254: 141.78,28.33 C24.1 141.27,27.82 U4.16 | U4.15 141.78,28.33 | U3.2 102.28,8.79 C13.2 102.89,9.4 R9.1 | 141.78,28.33 141.79,28.34 v141.79,28.96
  Top 0.5: C13.2 C12.2 102.99,12.47 C14.2 v102.88,16.43 102.88,18.38 103.64,19.14 R32.2 105.61,19.14 Q8.1 | R22.2 | R22.2 R23.2 | J1.4 45.19,15.98 45.17,16 v45.17,19.3 | 20.78,43.14 52.24,43.14 56.26,39.12 56.08,38.94 54.02,36.88 C18.2 52.59,19.37 C17.2 52.57,19.37 C19.2 51.11,19.34 R19.2 R20.2 R21.2 46.29,19.3 v45.17,19.3 | 20.78,43.14 R27.2 | R28.2 20.78,23.08 20.78,25.46 | 20.78,25.46 20.78,29.41 | 20.78,29.41 20.78,31.42 | 20.78,31.42 20.78,43.14 | 20.78,31.42 20.74,31.46 R29.2 | 20.78,29.41 15.71,29.41 R31.1 | 20.78,25.46 20.76,25.48 R30.2 | v45.17,19.3 45.15,19.32 R22.2 | C9.2 | C10.2 | C11.2 127.32,15.87 | v121.54,16.46 121.54,16.49 124.12,19.07 126.16,21.11 | v115.06,16.46 R33.2 114.02,17.68 Q7.1 | R13.2 126.16,21.11 | 120.54,29.1 125.51,34.07 C22.2 130.25,36.35 L2.1 | 126.16,21.11 130.54,25.49 135.1,25.49 138.69,29.07 | 138.69,29.07 139.45,29.84 R26.2 R25.2 | C24.1 139.72,29.07 138.69,29.07 | 120.55,35.09 120.54,35.08 | 111.6,37.68 R17.1 | U5.11 v94.15,40.7
  Top 1: 92.74,38.94 95.34,38.94 95.37,38.97 | 92.74,38.94 90.22,38.94 | 90.22,38.94 87.66,38.94 | 87.66,38.94 56.08,38.94 | L1.2 C9.2 | C9.2 C10.2 | C10.2 C11.2 | 127.32,15.87 124.12,19.07 120.54,22.65 120.54,29.1 120.54,35.08 | 120.55,35.09 117.96,37.68 111.6,37.68 | U5.12 92.83,39.03 92.74,38.94 | U5.11 95.37,38.97 | U5.13 90.29,39.01 90.22,38.94 | U5.14 87.75,39.03 87.66,38.94 | 111.6,37.68 | 95.37,38.97 106.7,38.97 107.99,37.68 111.6,37.68
  Bottom 0.254: P12.P$1 v45.17,19.3 | P7.P$1 121.54,15.81 v121.54,16.46 | P48.P$1 v141.8,28.97 v141.79,28.96
  Bottom 0.5: v121.54,16.46 v115.06,16.46 102.91,16.46 v102.88,16.43 | v94.15,40.7 v94.14,40.71 P27.P$1
  pour Top: 122.68,20.09 122.68,18.56 123.85,17.39 125.26,17.39 125.26,19.19 124.09,20.36 122.77,20.36 122.65,20.24 122.65,20.09
  pour Top: 53.83,41.52 53.82,36.5 56.48,39.14
3V3_RX  (via drill 0.35)
  Top 0.254: U3.36 80.79,12.6 82.92,14.73 v82.92,14.82 | Q8.2 104.69,17.43 R32.1 104.5,15.54 108.82,11.22 108.82,8.99 107.95,8.12 v99.59,8.12
  Bottom 0.254: v82.92,14.82 90.55,14.82 97.25,8.12 v99.59,8.12
3V3_TX  (via drill 0.35)
  Top 0.254: U3.37 78.95,11.43 81.01,11.43 v83.44,13.86 | Q7.2 114.9,19.36 R33.1 115.06,18.9 115.84,18.12 115.84,15.09 108.21,7.46 v100.73,7.46
  Bottom 0.254: v83.44,13.86 84.2,13.86 90.14,13.86 96.54,7.46 v100.73,7.46
5V_RX
  Top 0.254: R34.1 R6.1 111.72,18.46 Q7.3
5V_TX
  Top 0.254: Q8.3 107.91,18.46 R5.1 109.1,16.3 R35.1
BAT  (via drill 0.35)
  Top 0.5: B1.1 v135.42,7.41 135.42,9.57 | D3.A 145.3,8.78 Q3.3 142.86,8.84 141.37,10.33 C6.2 C5.2 137.37,10.33 136.61,9.57 135.42,9.57 | U6.3 134.29,10.7 135.42,9.57
  Bottom 0.254: v135.42,7.41 135.4,7.39 P5.P$1
  pour Top: 134.18,10.56 135.37,8.75 136.95,9.56 136.71,9.89
BOOT  (via drill 0.35)
  Top 0.254: U3.27 78.81,23.99 77.29,23.99 77.27,24.01 v77.27,24.03 | v119.47,38.24 121.3,40.07 121.3,50.22 K1.2 | Q2.3 114.55,35.83 v114.55,34.73
  Bottom 0.254: v77.27,24.03 77.27,27.42 78.7,28.85 104.68,28.85 110.56,34.73 v114.55,34.73 116.08,34.73 119.53,38.18 v119.47,38.24
D+
  Top 0.254: J2.A6 119.74,9.3 120.09,9.65 120.69,9.65 120.74,9.6 | 120.74,9.6 J2.B6 | 120.74,9.6 120.74,12.18 R3.1
D-
  Top 0.254: J2.A7 120.24,6.96 120.03,6.75 119.48,6.75 119.24,6.99 J2.B7 119.24,12.19 R2.1
DTR
  Top 0.254: Q2.2 115.47,30.53 114.72,29.78 113.77,29.78 | U1.13 111.73,28.58 112.92,29.78 113.77,29.78 | 113.77,29.78 R7.1
EN_RESET  (via drill 0.35)
  Top 0.254: U3.3 99.39,10.06 100.25,10.92 | R9.2 100.25,10.92 | 100.25,10.92 100.25,12.72 102.22,14.69 102.22,18.77 105.55,22.1 105.55,31.52 110.8,36.77 111.43,36.77 | 111.43,36.77 117.36,36.77 v118.35,35.78 | v120.1,37.53 120.1,37.55 129.46,46.91 133.51,46.91 C2.2 134.9,50.21 K2.2 | Q1.3 111.4,36.74 111.43,36.77
  Bottom 0.254: v118.35,35.78 118.35,35.81 120.07,37.53 v120.1,37.53
GDR  (via drill 0.35)
  Top 0.254: U4.2 v141.78,34.82 141.08,35.52 139.21,35.52 | 139.21,35.52 136.36,35.52 Q4.1 | R18.2 139.21,36.29 139.21,35.52
  Bottom 0.254: P36.P$1 141.43,34.47 v141.78,34.82
GND  (via drill 0.35, 3.2 pad 5)
  Top 0.254: J1.G1 v37.16,14.12 | U5.8 91.51,45.7 v91.53,45.68 | J2.A1 J2.B12 116.45,8.61 v114.82,8.61 | B1.2 v137.38,5.43
  Bottom 0.254: v37.16,14.12 35.77,14.12 P13.P$1 | v91.53,45.68 92.83,45.68 P35.P$1 | v114.82,8.61 114.31,8.61 P1.P$1 | v137.38,5.43 P6.P$1
  other vias: 163.71,52.73 133.95,28.49 163.71,4.22 33.95,28.49 4.21,52.73 4.21,4.22 118.01,15.24 154.76,11.05 26.63,5.55 31.3,5.71 31.33,3.04 26.6,2.72 17.96,6.92 21.28,4.79 21.68,13.57 14.01,9.02 19.23,15.42 10.44,12.78 9.69,17.05 9.7,21.66 9.72,37.15 9.72,39.52 9.58,41.82 9.43,44.64 10.32,49.84 17.54,48.76 18.51,54.45 24.5,54.9 25.52,45.09 28.63,44.73 24.77,49.58 18.63,45.17 18.09,40.06 23.18,40.51 42.85,7.45 49.39,7.45 56.56,7.75 62.8,7.73 62.74,22.99 65.84,19.3 68.46,16.18 70.26,7.77 75.94,7.77 82.57,7.9 84.92,7.81 86.8,7.83 91.53,7.65 93.36,7.72 85.89,12.97 85.48,16.23 107.5,14.92 113.94,5.07 94.95,7.75 123.43,13.76 134.86,23.95 127.66,19.23 121.55,17.83 119.11,24.95 124.13,26.2 124.08,23.32 129.9,26.61 118.57,30.86 119.22,26.7 118.75,32.52 146.29,3.02 150.16,3.26 153.12,6.65 155.36,16.55 152,20.37 145.04,35.31 125.95,5.04 125.95,6.78 155.99,28.54 155.98,33.5 146.39,35.31 145.61,43.02 147.06,44.74 139.53,46.71 137.07,46.69 141.74,46.72 128.02,47.44 126.52,46.07 122.32,43.91 122.96,39.3 122.79,34.78 114.55,41.73 116.99,33.84 110.03,38.96 106.22,36.46 105.22,40.8 105.41,45.14 105.04,49.43 102.53,52.76 103.44,51.96 108.35,53.13 93.77,54.84 84.1,54.74 75.47,54.92 47.96,40.06 52.43,40.38 57.77,40.65 58.36,37.3 62.3,26.81 62.56,37.36 93.42,29.81 88.61,32.71 100.53,17.57 113.94,6.82 99.7,13.76 131.64,19.19 131.32,17.4 133.67,19.78 135.25,19.72 136.97,19.67 138.92,18.79 138.97,16.98 141.26,15.97 139.22,14.37 138.16,13.11 136.25,12.85 134.34,12.83 132.77,13.5 132.31,42.95 128.47,40.8 127.24,38.96 127.54,36.83 128.77,35.27 131.47,35.29 136.78,39.83 149.7,37.01 133.15,38.06 132.77,36.38 93.01,37.55 94.81,19.6 94.84,18.01 148.66,12.73 149.69,12.7 127.58,26.6 127.52,24.31 105.8,13.17 105.81,12.2 144.21,20.35 145.91,20.34 116.89,15.22 77.16,49.98 34.04,54.39 33.6,49.87 42.76,54.75 42.45,49.93 52.35,54.76 51.73,49 63.79,54.45 63.36,49 64.53,41.44 131.46,8.55 131.5,7.42 131.5,6.33 132.91,7.48 133.91,8.54 130.03,12.21
  pour Top (rank 2): -2.88,58.83 -2.88,-1.19 55.49,-1.19 55.49,6.93 112.5,6.93 112.5,-1.3 170.43,-1.3 170.43,58.83
  pour Bottom (rank 2): -2.79,58.76 -2.79,-1.18 55.42,-1.18 55.45,-1.21 55.45,6.86 55.51,6.92 112.51,6.92 112.51,-1.27 170.38,-1.27 170.38,58.76
IO1_EXIT
  Top 0.254: K4.2 6.38,17.98 R28.1 14.16,12.58 14.64,12.1 17.95,8.79 U3.39
IO2_MENU  (via drill 0.35)
  Top 0.254: v26.11,10.05 26.3,10.05 26.31,10.06 U3.38 | K3.2 v10.75,43.17 14.1,43.17 R27.1
  Bottom 0.254: v26.11,10.05 18.02,10.05 10.73,17.34 10.73,43.15 v10.75,43.17
IO3  (via drill 0.35)
  Top 0.254: U5.1 73.43,45.7 73.45,45.72 v73.6,45.72 | v73.65,37.87 86.67,37.87 94.85,29.69 U3.15
  Bottom 0.254: v73.65,37.87 73.6,37.92 v73.6,45.72 P28.P$1
IO4_DOWN  (via drill 0.35)
  Top 0.254: R30.1 v12.95,25.48 9.6,25.48 K5.1 | v93.23,9.68 93.23,9.72 94.84,11.33 U3.4
  Bottom 0.254: v12.95,25.48 12.95,18.84 19.61,12.18 88.62,12.18 91.18,9.62 93.17,9.62 v93.23,9.68
IO5_CONF  (via drill 0.35)
  Top 0.254: R31.2 14.15,29.43 v12.23,29.43 9.63,29.43 K5.4 | v90.18,9.4 90.2,9.38 91.68,9.38 94.9,12.6 U3.5
  Bottom 0.254: v12.23,29.43 12.23,18.32 18.94,11.61 87.97,11.61 v90.18,9.4
IO6_UP  (via drill 0.35)
  Top 0.254: v88.43,10.11 v88.44,10.1 91.04,10.1 94.81,13.87 U3.6 | K5.2 9.62,31.5 v11.42,31.5 14.11,31.5 R29.1
  Bottom 0.254: v88.43,10.11 87.73,10.81 19.15,10.81 11.41,18.55 11.41,31.27 11.42,31.28 v11.42,31.5
IO7_LCD_3.3_CTL  (via drill 0.35)
  Top 0.254: U3.7 v101.34,15.14 v101.35,15.15 | R172.1 126.08,30.6 v124.24,28.76
  Bottom 0.254: v101.35,15.15 101.35,19.01 105.79,23.45 112.42,23.45 117.73,28.76 v124.24,28.76
IO8  (via drill 0.35)
  Top 0.254: U5.20 v70.99,40.7 v70.98,40.71 | v99.92,29.77 99.92,23.88 97.51,21.47 96.87,21.47 U3.12
  Bottom 0.254: v99.92,29.77 v99.91,29.78 99.91,46.78 93.5,53.19 77.87,53.19 70.98,46.3 v70.98,40.71 P20.P$1
IO9  (via drill 0.35)
  Top 0.254: U3.17 92.3,31.57 86.69,37.18 76.77,37.18 v76.75,37.2 | U5.2 75.07,45.68 v75.07,44.15
  Bottom 0.254: v76.75,37.2 76.72,37.23 76.72,42.5 v75.07,44.15 75.07,45.7 P29.P$1
IO10_SPI_CS  (via drill 0.35)
  Top 0.254: J1.2 v47.39,16.1 v47.38,16.11 47.73,16.46 R20.1 | v91,29.51 91,25.56 U3.18
  Bottom 0.254: v91,29.51 90.95,29.56 56.17,29.56 47.38,20.77 v47.38,16.11 51.07,16.11 P8.P$1
IO11_SPI_MOSI  (via drill 0.35)
  Top 0.254: U4.14 146.5,28.82 146.9,28.42 v146.9,28.17 | v89.76,21.42 U3.19
  Bottom 0.254: v146.9,28.17 146.9,19.06 | 146.9,19.06 146.9,17.18 141.26,11.54 99.42,11.54 89.76,21.2 v89.76,21.42 | P55.P$1 146.85,19.11 146.9,19.06
IO12_SPI_CLK  (via drill 0.35)
  Top 0.254: U4.13 146.71,29.32 v147.85,28.17 | v88.54,21.43 88.54,25.48 U3.20
  Bottom 0.254: v88.54,21.43 88.54,21.38 98.82,11.1 142.02,11.1 147.85,16.93 v147.85,28.17 147.31,28.71 147.31,33.45 151.45,37.59 P54.P$1
IO13_SPI_MISO  (via drill 0.35)
  Top 0.254: R22.1 42.39,17.77 42.39,16.76 v41.89,16.26 J1.7 | U3.21 87.14,25.61 v87.14,32.2
  Bottom 0.254: v87.14,32.2 53.34,32.2 41.89,20.75 v41.89,16.26 41.78,16.15 P11.P$1
IO14  (via drill 0.35)
  Top 0.254: U5.19 75.05,42.36 v75.07,42.38 v75.09,42.36 | v75.96,36.61 75.96,33.51 81.67,27.8 v83.53,27.8 | v85.96,27.8 U3.22
  Bottom 0.254: v75.09,42.36 75.97,41.48 75.97,40.71 75.96,40.71 | 75.96,40.71 v75.96,36.61 | v83.53,27.8 v85.96,27.8 | P21.P$1 75.96,40.71
IO15  (via drill 0.35)
  Top 0.254: U5.3 77.59,47.21 v79.07,48.68 82.81,52.43 v101.26,52.43 | v103.84,29.72 103.84,22.37 97.88,16.41 U3.8
  Bottom 0.254: v101.26,52.43 103.84,49.85 v103.84,29.72 | P30.P$1 77.57,47.19 v79.07,48.68
IO16  (via drill 0.35)
  Top 0.254: U3.9 97.87,17.68 102.81,22.62 102.8,22.63 v102.8,29.72 | v100.16,51.42 83.32,51.42 78.86,46.96 78.86,43.37 v77.95,42.46 77.59,42.1 U5.18
  Bottom 0.254: v100.16,51.42 102.81,48.77 102.81,29.73 v102.8,29.72 | P22.P$1 77.59,42.1 v77.95,42.46
IO17  (via drill 0.35)
  Top 0.254: U5.4 80.13,47.02 v81.78,48.67 83.69,50.58 v99.1,50.58 | v101.84,29.74 101.84,23.05 97.74,18.95 U3.10
  Bottom 0.254: v99.1,50.58 101.83,47.85 v101.83,29.74 v101.84,29.74 | P31.P$1 80.1,46.99 v81.78,48.67
IO18  (via drill 0.35)
  Top 0.254: v100.88,29.72 100.88,23.22 97.88,20.22 U3.11 | v98.31,49.68 84.3,49.68 81.51,46.89 81.51,43.38 v80.54,42.41 80.13,42 U5.17
  Bottom 0.254: v100.88,29.72 100.88,47.11 v98.31,49.68 | P23.P$1 80.13,42 v80.54,42.41
IO19  (via drill 0.35)
  Top 0.254: U5.5 82.67,46.84 v83.14,47.31 | v98.95,29.76 98.97,29.74 98.97,24.23 97.48,22.74 96.87,22.74 U3.13
  Bottom 0.254: v98.95,29.76 98.95,29.79 98.95,46.7 97.2,48.45 84.28,48.45 v83.14,47.31 82.67,46.84 P32.P$1
IO20  (via drill 0.35)
  Top 0.254: U5.16 84.1,40.7 v84.12,40.72 | v97.96,29.77 98,29.73 98,24.24 97.79,24.03 U3.14
  Bottom 0.254: v97.96,29.77 97.96,46.07 96.4,47.63 84.67,47.63 84.12,47.08 84.12,42.17 v84.12,40.72 82.74,40.72 P24.P$1
IO21  (via drill 0.35)
  Top 0.254: U3.23 v84.68,35.83 v84.69,35.84 | v85.22,44.12 U5.6
  Bottom 0.254: v84.69,35.84 84.69,35.88 86.97,38.16 86.97,42.37 v85.22,44.12 v85.23,44.13 P33.P$1
IO38  (via drill 0.35)
  Top 0.254: U5.15 86.28,40.7 v86.28,40.68 | v69.05,35.86 69.05,25.58 75.68,18.95 U3.31
  Bottom 0.254: v69.05,35.86 69.73,35.86 83.53,35.86 86.28,38.61 v86.28,40.68 85.24,40.68 P25.P$1
IO39_SPI_CLK  (via drill 0.35)
  Top 0.254: U3.32 78.82,17.65 75.09,17.65 67.96,24.77 v67.96,31.2 | J1.5 v44.09,17.75
  Bottom 0.254: v67.96,31.2 54.22,31.2 44.09,21.07 v44.09,17.75 44.09,16.79 P10.P$1
IO40_SPI_MOSI  (via drill 0.35)
  Top 0.254: J1.3 v46.29,16.64 46.29,17.78 R21.1 | U3.33 74.63,16.41 66.57,24.47 v66.57,30.39
  Bottom 0.254: v66.57,30.39 55.42,30.39 46.29,21.26 v46.29,16.64 46.27,16.62 46.27,15.68 47.25,14.7 P9.P$1
IO41_LED  (via drill 0.35)
  Top 0.254: v65.4,33.68 65.4,23.86 74.25,15.01 78.72,15.01 U3.34 | v97.18,44.33 104.62,51.77 108.63,51.77 R16.1
  Bottom 0.254: v65.4,33.68 v65.4,33.67 87.63,33.67 91.78,37.82 91.78,41.87 94.24,44.33 v97.18,44.33
IO42_TF_3.3_CTL
  Top 0.254: U3.35 78.8,13.82 64.54,13.82 61.51,16.85 R15.1
IO45_CS  (via drill 0.35)
  Top 0.254: U4.12 147.4,29.82 v148.15,29.07 | v80.77,20.51 80.77,25.45 U3.26
  Bottom 0.254: v80.77,20.51 88.62,20.51 98.47,10.66 142.54,10.66 148.59,16.71 148.59,28.63 v148.15,29.07 148.06,29.17 148.06,33.05 150.68,35.68 P53.P$1
IO46_D/C  (via drill 0.35)
  Top 0.254: U4.11 148.19,30.32 v148.84,29.67 | v90.44,17.69 93.57,20.82 U3.16
  Bottom 0.254: v90.44,17.69 90.44,17.65 97.89,10.2 142.97,10.2 149.18,16.41 149.18,29.33 v148.84,29.67 148.46,30.05 148.46,31.97 150.1,33.61 152.26,33.61 P52.P$1
IO47_RES  (via drill 0.35)
  Top 0.254: v149.61,30.3 149.09,30.82 U4.10 | v83.47,18.7 83.47,25.47 U3.24
  Bottom 0.254: v83.47,18.7 88.3,18.7 97.21,9.79 143.36,9.79 149.72,16.15 149.72,30.19 v149.61,30.3 149.53,30.38 149.53,31.51 149.83,31.81 P51.P$1
IO48_BUSY  (via drill 0.35)
  Top 0.254: v82.12,17.93 82.12,25.51 U3.25 | U4.9 145.41,31.32 150.06,31.32 v150.24,31.14
  Bottom 0.254: v82.12,17.93 88.07,17.93 96.7,9.3 143.86,9.3 150.37,15.81 150.37,28.93 | v150.24,31.14 150.37,31.01 150.37,28.93 | P50.P$1 152.4,28.93 150.37,28.93
LCD_GND  (via drill 0.35)
  Top 0.254: U4.17 144.01,27.32 | 144.04,31.85 143.19,31.85 U4.8
  Top 0.5: Q9.3 131.29,32.66 131.8,33.17 131.8,34.04 C22.1 v136.9,34.07 | v136.9,34.07 137.5,34.07 | 137.5,34.07 138.23,34.8 R18.1 R24.1 | 137.5,34.07 137.56,34.07 138.55,33.08 139.41,33.08 C23.2 | v138.43,27.65 138.45,27.67 C24.2 C25.2 C26.2 C27.2 C28.2 | v136.9,32.27 v136.9,34.07 | v138.43,38.57 139.88,40.02 C29.1 v144.3,40.02 v144.31,40.01 146.5,40.01 148.42,38.09 148.42,35.84 v144.58,32 144.43,31.85 144.04,31.85 | 144.01,27.32 v144.58,27.32 | D5.C 140.62,43.33 C20.1 144.21,43.33 v144.22,43.34
  Bottom 0.5: v138.43,27.65 136.9,29.18 v136.9,32.27 | v144.58,32 v144.58,27.32 v144.57,27.33 P42.P$1 | v144.31,40.01 144.25,40.07 144.25,43.34 v144.22,43.34 | v138.43,38.57 136.9,37.04 136.9,35.31 | 136.9,35.31 v136.9,34.07 | P43.P$1 136.86,35.27 136.9,35.31
N$1
  Top 0.254: R7.2 111.43,31 110.37,32.06 110.37,33.74 Q1.1
N$2
  Top 0.254: U1.2 109.19,20.07 R5.2
N$3
  Top 0.254: U1.3 110.46,20.03 R6.2
N$4
  Top 0.254: R8.2 113.57,32.61 Q2.1
N$5
  Top 0.3: J2.A5 118.74,11.36 R1.2
N$6
  Top 0.254: R10.2 R11.1 147.63,12.72 148.14,12.21 148.14,5.82 147.74,5.43 145.37,5.43 144.94,5.86 144.94,6.86 144.35,7.45 142.62,7.45 141.86,6.7 Q3.1
N$7
  Top 0.254: R172.2 129.15,30.6 Q9.1
N$8
  Top 0.254: R15.2 Q10.1
N$9
  Top 0.254: R14.2 R13.1 139.7,21.11 142.47,18.34 U2.5
N$10
  Top 0.254: J1.1 48.49,16.09 49.13,16.73 R19.1
N$11
  Top 0.8: U2.3 L1.1
N$12
  Top 0.3: J2.B5 121.74,11.87 R4.1
N$13
  Top 0.254: U1.4 111.76,22.03 111.76,21.2 112.39,20.57 C15.1
N$16
  Top 0.254: U6.5 R12.2
N$18
  Top 0.254: U4.6 142.07,32.82 R25.1
N$19
  Top 0.254: U4.7 142.35,32.32 142,31.97 142,30.92 141.4,30.32 R26.1
N$20
  Top 0.254: J1.8 40.79,17.64 R23.1
N$25
  Top 0.254: R17.2 D1.+ | D1.+ | R16.2 110.93,52.49 112.41,52.49 D1.+
N$55
  Top 0.5: D5.A 135.19,43.19 134.33,44.05 | 134.33,44.05 134.43,44.05 135.25,44.87 D4.C | C21.1 134.33,44.05
N$56
  Top 0.8: 130.28,42.49 C21.2
  Top 1: 130.28,41.69 130.28,42.49 | D6.A 136.5,41.69 130.28,41.69 | Q4.3 134.84,39.49 134.73,39.6 L2.2 130.3,41.67 130.28,41.69
  pour Top: 130.03,41.93 133.72,41.93 133.81,41.84 133.81,39.53 133.72,39.44 130.54,39.44 130.33,39.65 130.33,41.6 130.03,41.9
PREVGH  (via drill 0.35)
  Top 0.254: U4.21 143.18,25.34 148.45,25.34 148.5,25.29 150.96,27.74 150.96,37.24 v149.07,39.13 146.66,41.54 C29.2 142.25,41.51 D6.C
  Bottom 0.254: P56.P$1 152.3,42.37 v149.07,39.13
PREVGL  (via drill 0.35)
  Top 0.254: D4.A 142.19,44.87 C20.2 145.46,44.85 v151.35,38.96 151.47,38.84 151.47,27.59 147.65,23.76 144.48,23.76 143.92,24.32 U4.23
  Bottom 0.254: P57.P$1 152.35,39.95 v151.36,38.96 v151.35,38.96
RESE  (via drill 0.35)
  Top 0.254: U4.3 143.87,34.32 144.1,34.55 144.1,36.29 143.3,37.09 v142.75,37.64 140.65,37.64 | Q4.2 140.65,37.64 | R24.2 140.58,37.57 140.65,37.64
  Bottom 0.254: P37.P$1 142.83,37.64 v142.75,37.64
RTS  (via drill 0.35)
  Top 0.254: v110.47,30.92 110.46,30.9 U1.14 | R8.1 112.24,32.42 v111.12,32.42 111.12,33.02 111.93,33.82 Q1.2
  Bottom 0.254: v110.47,30.92 110.47,31.77 v111.12,32.42
TF_GND  (via drill 0.35)
  Top 0.254: Q10.3 55.35,17.76 v55.35,16.5
  Top 0.5: J1.6 42.99,13.65 43.42,13.22 50.08,13.22 51.14,14.28 C19.1 C17.1 54.01,17.84 C18.1 55.27,17.85 Q10.3
  Bottom 0.254: v55.35,16.5 P45.P$1
USB_D+  (via drill 0.35)
  Top 0.254: R3.2 120.68,13.76 v120.68,19.13 120.68,21.34 118.36,23.66 113.8,23.66 113,22.85 U1.5
  Bottom 0.254: P4.P$1 v120.68,19.13
USB_D-  (via drill 0.35)
  Top 0.254: R2.2 v119.28,19.13 119.28,21.87 117.97,23.18 114.61,23.18 114.27,22.83 U1.6
  Bottom 0.254: P3.P$1 v119.28,19.13
VBUS  (via drill 0.35)
  Top 0.254: 117.6,7.96 J2.A4 J2.B9 117.58,8.28 | 122.39,7.97 J2.B4 | J2.A9 J2.B4 | J2.B4 122.38,8.26
  Top 0.5: 117.6,7.96 117.6,7.11 119.07,5.64 120.91,5.64 122.39,7.12 122.39,7.97 | 122.38,8.26 122.38,9.18 123.08,9.87 | 127.29,10.62 C4.2 | 123.78,10.58 123.79,10.58 123.88,10.67 125.83,12.62 v125.83,15.81 | U1.16 107.95,27.05 C1.1 107.92,28.71 v107.92,29.96 | v115.62,12.46 117.58,10.5 117.58,8.28 | v110.47,12.44 109.09,13.82 R35.2 | R34.2 110.5,13.85 111.91,12.44 v112.03,12.44
  Top 0.8: 123.78,10.58 123.08,9.87 | 127.29,10.62 C3.2 130.1,10.62 U6.4 131.07,11.59 144.67,11.59 | C4.2 123.88,10.67 | D2.1 145.59,11.59 144.67,11.59 | 144.67,11.59 144.67,13.88 R10.1
  Bottom 0.254: 125.73,15.91 v125.83,15.81
  Bottom 0.5: v115.62,12.46 112.05,12.46 v112.03,12.44 v110.47,12.44 | v107.92,29.96 124.24,29.96 125.83,28.37 v125.83,15.81
  Bottom 1: P2.P$1 125.73,15.91
VCOM  (via drill 0.35)
  Top 0.254: C28.1 v142.24,23.19 142.87,23.82 U4.24
  Bottom 0.254: P62.P$1 v142.24,23.19
VDD  (via drill 0.35)
  Top 0.254: C25.1 141.67,26.82 U4.18 143.2,26.78 144.19,26.78 144.34,26.64 145.25,26.64 145.77,27.16 v145.77,27.35
  Bottom 0.254: v145.77,27.35 P49.P$1
VDHR  (via drill 0.35)
  Top 0.254: C23.1 141.17,33.32 U4.5 v144.42,33.33
  Bottom 0.254: v144.42,33.33 145.24,34.15 P58.P$1
VIN
  Top 0.5: Q3.2 143.86,5.89 145.02,4.73 149.33,4.73 150.86,6.25 D3.C 151.3,7.71 D2.2 C8.2 C7.2 142.53,15.93 U2.4 142.47,16.18 140.88,17.77 U2.1
VSH  (via drill 0.35)
  Top 0.254: C26.1 142.07,25.82 U4.20 143.87,25.82 144.28,26.23 v145.89,26.23 v145.9,26.24
  Bottom 0.254: P60.P$1 145.9,24.54 v145.9,26.24
VSL  (via drill 0.35)
  Top 0.254: C27.1 142.47,24.82 U4.22 144.39,24.82 v144.53,24.68
  Bottom 0.254: v144.53,24.68 144.5,24.65 P61.P$1

### Text on the board
tPlace: H1 | H2 | IO2 | ESP32 Display-5.79(E) inch | E-paper | IO48 => LCD_BUSY / IO47 => LCD_RES / IO46 => LCD_D/C / IO45 => LCD_SPI_CS / IO12 => LCD_SPI_CLK / IO11 => LCD_SPI_MOSI | SKU:DIS08792E | V1.0 | IO3 | IO9 | IO15 | IO17 | IO19 | IO21 | GND | GND | GND | GND | IO8 | IO14 | IO16 | IO18 | IO20 | IO38 | 3V3 | 3V3 | 3V3 | 3V3 | H5 | IO7 | H6 | IO6 / IO5 / IO4 | IO42 | IO1 | IO10 => SPI_CS / IO40 => SPI_MOSI / IO39 => SPI_CLK / IO13 => SPI_MISO | + | - | H4 | H3